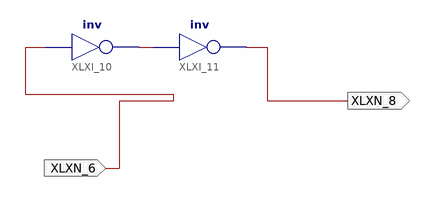
[diagram p0: schematic sheet 1]
// Xilinx ISE schematic lab5_4.sch (spartan6) as structural Verilog: 2 symbols, 2 ports
module lab5_4 (
  input  XLXN_6,
  output XLXN_8
);

  wire XLXN_11;

  not XLXI_10 (XLXN_11, XLXN_6);
  not XLXI_11 (XLXN_8, XLXN_11);
endmodule
